# EasyEDA schematic SCH_N3 FLIGHT COMPUTER_2023-10-18 (1).json
TITLE: NAKUJA N3 FLIGHT COMPUTER; REV: 1.0; Date: 2023-10-05; Sheet: 1/1; Drawn By: Kisaka the Jones; Company: JICA NAKUJA
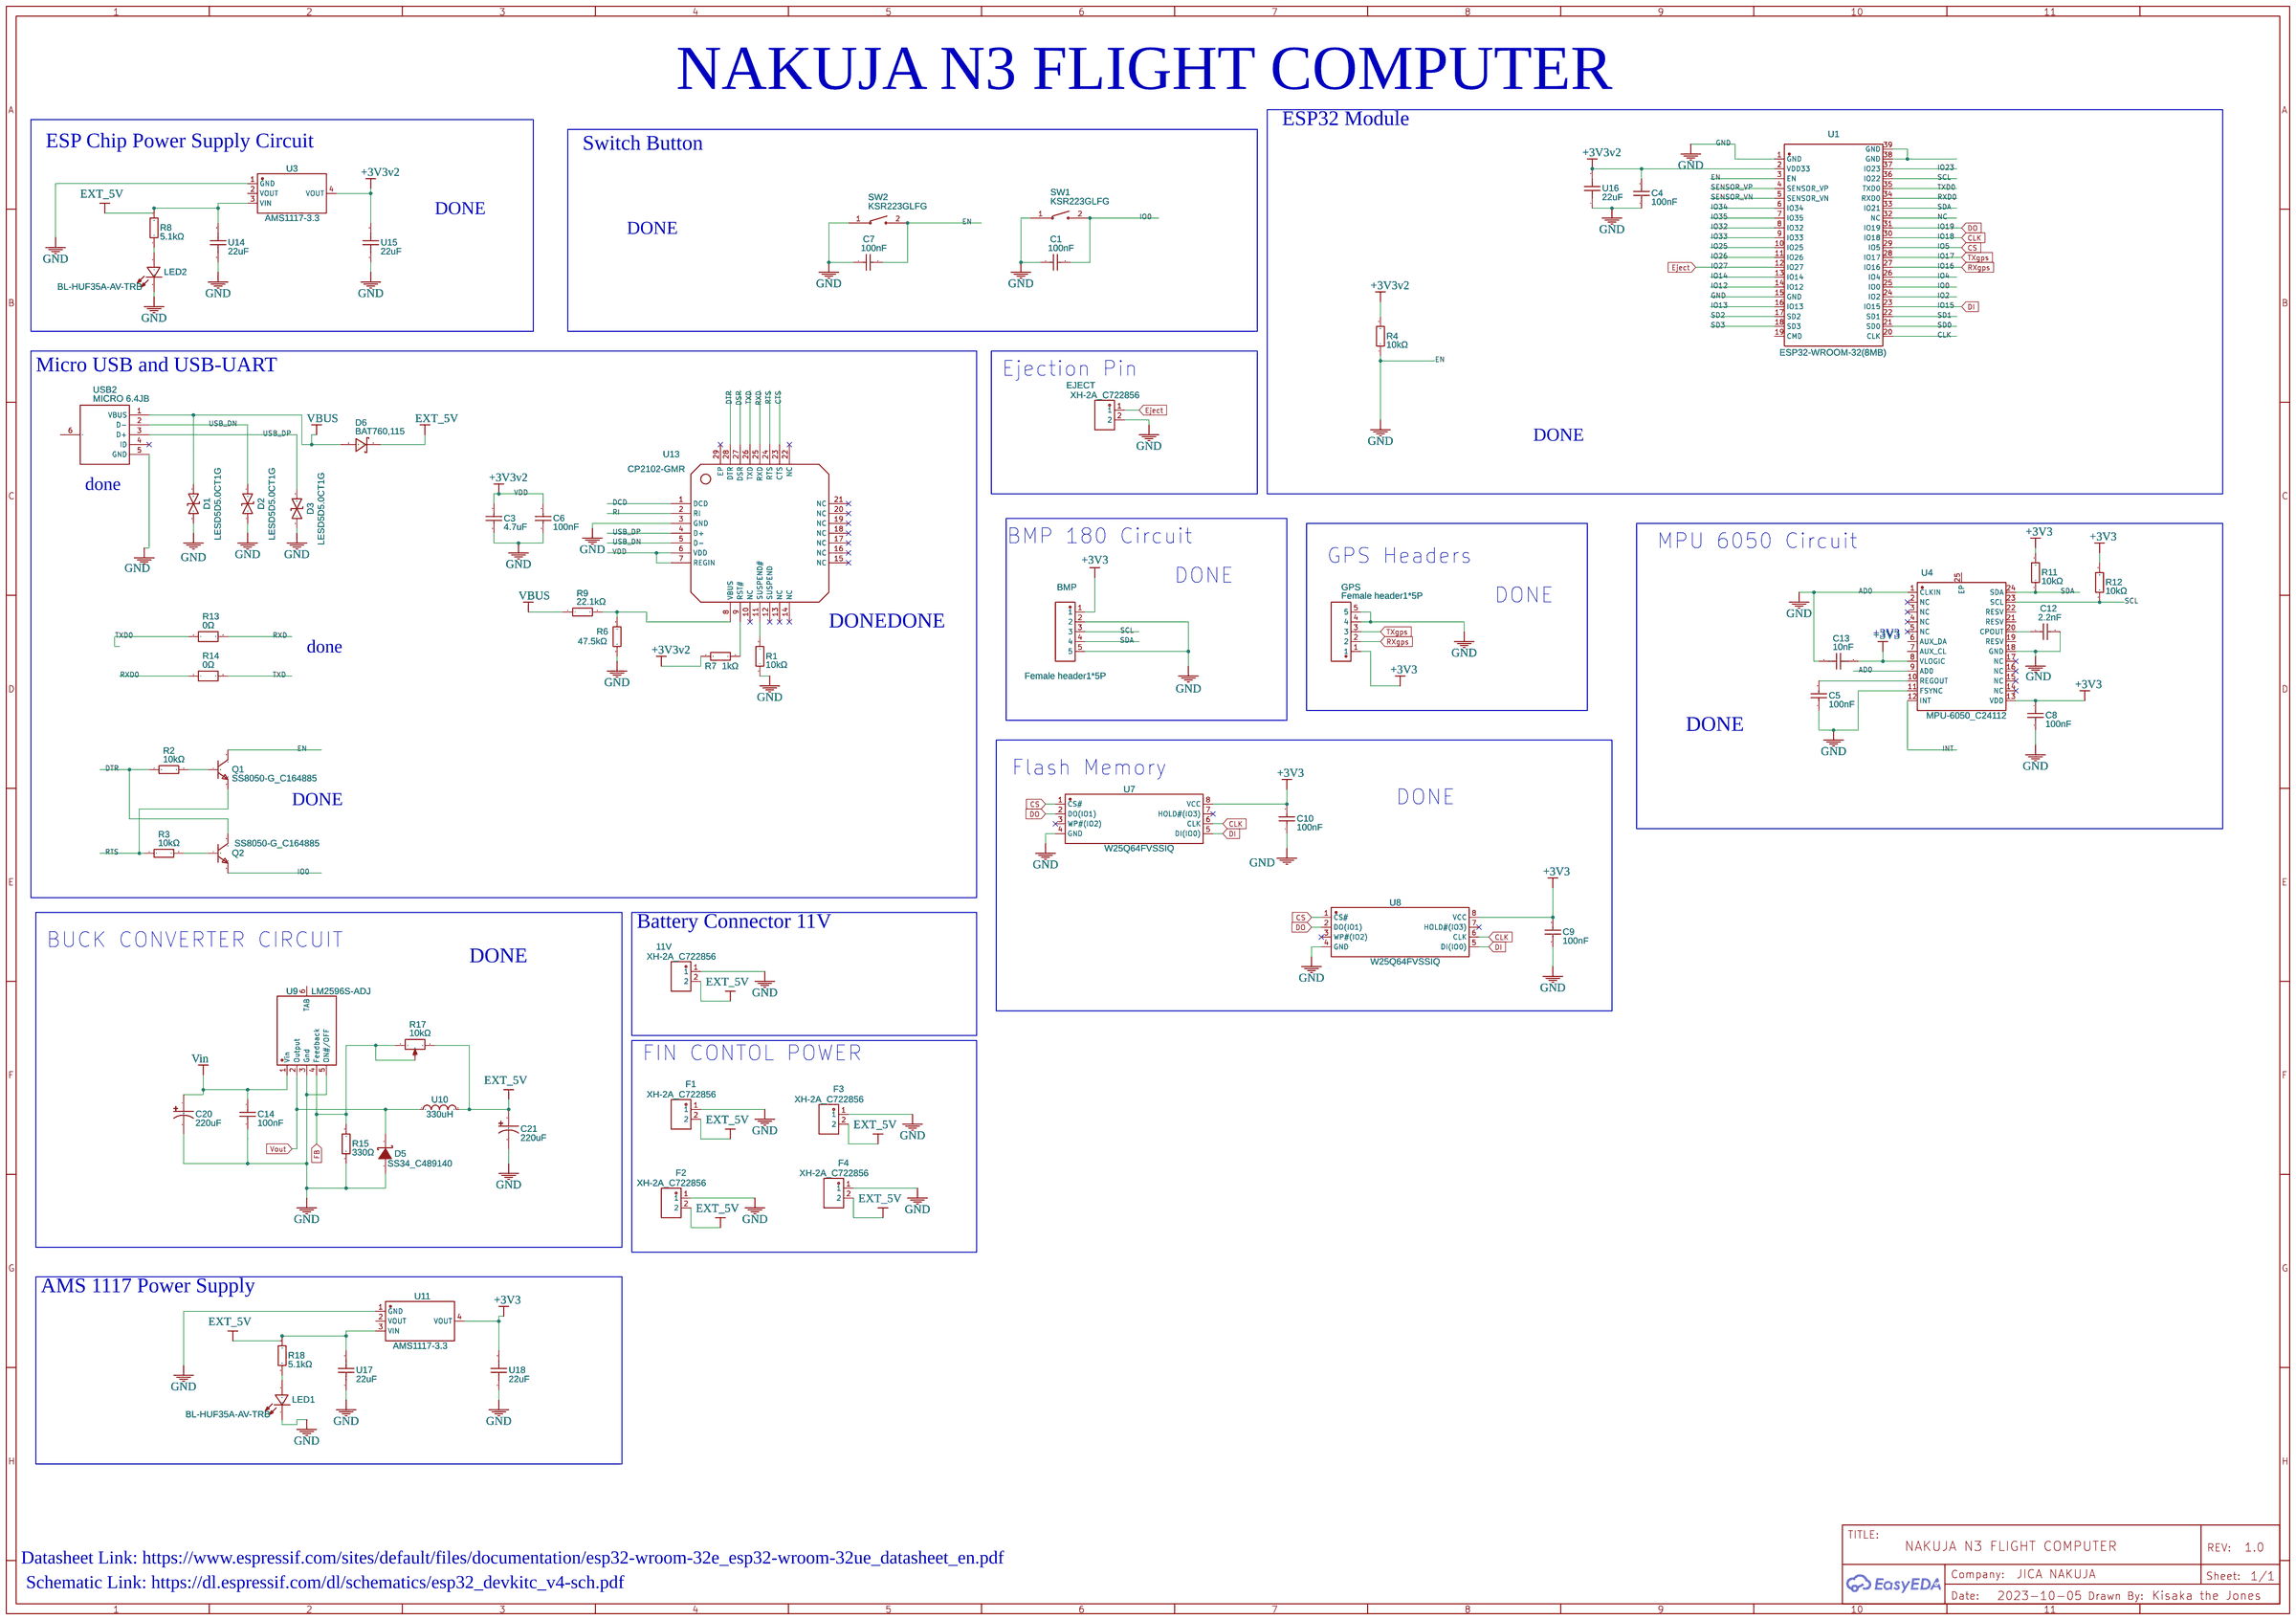
[diagram p0: schematic sheet]

## Parts
11V  XH-2A_C722856  [CONN-TH_XH-2A_C722856]
BMP  Female header1*5P  [HDR-TH_5P-P2.00-V-F-1]
C1  100nF  [C0402]
C3  4.7uF  [C0805]
C4  100nF  [C0402]
C5  100nF  [C0402]
C6  100nF  [C0402]
C7  100nF  [C0402]
C8  100nF  [C0402]
C9  100nF  [C0402]
C10  100nF  [C0402]
C12  2.2nF  [C0805]
C13  10nF  [C0805]
C14  100nF  [C0402]
C20  220uF  [CAP-SMD_BD10.0-L10.3-W10.3-FD]
C21  220uF  [CAP-SMD_BD10.0-L10.3-W10.3-FD]
D1  LESD5D5.0CT1G  [SOD-523_L1.2-W0.8-LS1.6-BI]
D2  LESD5D5.0CT1G  [SOD-523_L1.2-W0.8-LS1.6-BI]
D3  LESD5D5.0CT1G  [SOD-523_L1.2-W0.8-LS1.6-BI]
D5  SS34_C489140  [SMA_L4.3-W2.6-LS5.2-RD]
D6  BAT760,115  [SOD-323_L1.7-W1.3-LS2.5-RD]
EJECT  XH-2A_C722856  [CONN-TH_XH-2A_C722856]
F1  XH-2A_C722856  [CONN-TH_XH-2A_C722856]
F2  XH-2A_C722856  [CONN-TH_XH-2A_C722856]
F3  XH-2A_C722856  [CONN-TH_XH-2A_C722856]
F4  XH-2A_C722856  [CONN-TH_XH-2A_C722856]
GPS  Female header1*5P  [HDR-TH_5P-P2.00-V-F-1]
LED1  BL-HUF35A-AV-TRB  [LED0805-RD_RED]
LED2  BL-HUF35A-AV-TRB  [LED0805-RD_RED]
Q1  SS8050-G_C164885  [SOT-23-3_L2.9-W1.3-P1.90-LS2.4-BR]
Q2  SS8050-G_C164885  [SOT-23-3_L2.9-W1.3-P1.90-LS2.4-BR]
R1  10kΩ  [R1206]
R2  10kΩ  [R1206]
R3  10kΩ  [R1206]
R4  10kΩ  [R1206]
R6  47.5kΩ  [R0402]
R7  1kΩ  [R0402]
R8  5.1kΩ  [R0402]
R9  22.1kΩ  [R0402]
R11  10kΩ  [R1206]
R12  10kΩ  [R1206]
R13  0Ω  [R0402]
R14  0Ω  [R0402]
R15  330Ω  [R0603]
R17  10kΩ  [RES-ADJ-TH_3296W]
R18  5.1kΩ  [R0402]
SW1  KSR223GLFG  [KEY-SMD_2P-L6.0-W3.8-LS7.30-L]
SW2  KSR223GLFG  [KEY-SMD_2P-L6.0-W3.8-LS7.30-L]
U1  ESP32-WROOM-32(8MB)  [WIFIM-SMD_39P-L25.5-W18.0-P1.27]
U3  AMS1117-3.3  [SOT-223-3_L6.5-W3.4-P2.30-LS7.0-BR]
U4  MPU-6050_C24112  [QFN-24_L4.0-W4.0-P0.50-BL-EP2.7]
U7  W25Q64FVSSIQ  [SOIC-8_L5.3-W5.3-P1.27-LS8.0-BL]
U8  W25Q64FVSSIQ  [SOIC-8_L5.3-W5.3-P1.27-LS8.0-BL]
U9  LM2596S-ADJ  [TO-263-5_L10.2-W8.9-P1.70-BR]
U10  330uH  [IND-SMD_L12.5-W12.5_SLF12575T]
U11  AMS1117-3.3  [SOT-223-3_L6.5-W3.4-P2.30-LS7.0-BR]
U13  CP2102-GMR  [WQFN-28_L5.0-W5.0-P0.50-BL-EP3.2]
U14  22uF  [C0805]
U15  22uF  [C0805]
U16  22uF  [C0805]
U17  22uF  [C0805]
U18  22uF  [C0805]
USB2  MICRO 6.4JB  [MICRO-USB-SMD_C2681558]

## Library data of the parts
11V EJECT F1-F4 = XH-2A_C722856: Contributor: LCSC; Supplier: LCSC; Supplier Part: C722856; Manufacturer: CAX; Manufacturer Part: XH-2A; JLCPCB Part Class: Extended Part; link: https://lcsc.com/eda_search?q=C722856&%26type=1&ref=editor
BMP GPS = Female header1*5P: Supplier: LCSC; Manufacturer: BOOMELE(博穆精密); Manufacturer Part: 2.0-1*5P母; Supplier Part: C66508; JLCPCB Part Class: Extended Part; link: https://lcsc.com/eda_search?q=C66508&%26type=1&ref=editor
C1 C4-C10 C14 = FN15X104K160PNG: Contributor: LCSC; Supplier: LCSC; Supplier Part: C328914; Manufacturer: PSA(信昌电陶); JLCPCB Part Class: Extended Part; link: https://lcsc.com/eda_search?q=C328914&%26type=1&ref=editor
C3 = CL21B475KPFNNNE: Supplier: LCSC; Manufacturer: SAMSUNG(三星); Supplier Part: C87998; JLCPCB Part Class: Extended Part; link: https://lcsc.com/eda_search?q=C87998&%26type=1&ref=editor
C12 = 0805B222K500NT: Supplier: LCSC; Manufacturer: FH(风华); Supplier Part: C36576; JLCPCB Part Class: Extended Part; link: https://lcsc.com/eda_search?q=C36576&%26type=1&ref=editor
C13 = CC0805KRX7R9BB103: Supplier: LCSC; Manufacturer: YAGEO(国巨); Supplier Part: C83170; JLCPCB Part Class: Extended Part; link: https://lcsc.com/eda_search?q=C83170&%26type=1&ref=editor
C20 C21 = EEEFP1H221AP: Contributor: LCSC; Supplier: LCSC; Supplier Part: C178579; Manufacturer: PANASONIC(松下); JLCPCB Part Class: Extended Part; link: https://lcsc.com/eda_search?q=C178579&%26type=1&ref=editor
D1-D3 = LESD5D5.0CT1G: Contributor: LCSC; Supplier: LCSC; Supplier Part: C383211; Manufacturer: LRC(乐山无线电); JLCPCB Part Class: Extended Part; link: https://lcsc.com/eda_search?q=C383211&%26type=1&ref=editor
D5 = SS34_C489140: Contributor: LCSC; Supplier: LCSC; Supplier Part: C489140; Manufacturer: KEXIN(科信); Manufacturer Part: SS34; JLCPCB Part Class: Extended Part; link: https://lcsc.com/eda_search?q=C489140&%26type=1&ref=editor
D6 = BAT760,115: Contributor: LCSC; Supplier: LCSC; Supplier Part: C117941; Manufacturer: Nexperia(安世); JLCPCB Part Class: Extended Part; link: https://lcsc.com/eda_search?q=C117941&%26type=1&ref=editor
LED1 LED2 = BL-HUF35A-AV-TRB: Supplier: LCSC; Manufacturer: BrtLed(佰鸿); Supplier Part: C94741; JLCPCB Part Class: Extended Part; link: https://lcsc.com/eda_search?q=C94741&%26type=1&ref=editor
Q1 Q2 = SS8050-G_C164885: Contributor: LCSC; Supplier: LCSC; Supplier Part: C164885; Manufacturer: CJ(江苏长电/长晶); Manufacturer Part: SS8050-G; JLCPCB Part Class: Extended Part; link: https://lcsc.com/eda_search?q=C164885&%26type=1&ref=editor
R1-R4 R11 R12 = QR1206J10KP05: Contributor: LCSC; Supplier: LCSC; Supplier Part: C176266; Manufacturer: EVER OHMS(天二科技); Manufacturer Part: QR1206J10K0P05Z; JLCPCB Part Class: Extended Part; link: https://lcsc.com/eda_search?q=C176266&%26type=1&ref=editor
R6 = 0402WGF4752TCE: Supplier: LCSC; Manufacturer: UNI-ROYAL(厚声); Supplier Part: C25896; JLCPCB Part Class: Extended Part; link: https://lcsc.com/eda_search?q=C25896&%26type=1&ref=editor
R7 = 0402WGF1001TCE: Supplier: LCSC; Manufacturer: UNI-ROYAL(厚声); Supplier Part: C11702; JLCPCB Part Class: Basic Part; link: https://lcsc.com/eda_search?q=C11702&%26type=1&ref=editor
R8 R18 = 0402WGJ0512TCE: Supplier: LCSC; Manufacturer: UNI-ROYAL(厚声); Supplier Part: C25941; JLCPCB Part Class: Extended Part; link: https://lcsc.com/eda_search?q=C25941&%26type=1&ref=editor
R9 = 0402WGF2212TCE: Supplier: LCSC; Manufacturer: UNI-ROYAL(厚声); Supplier Part: C43473; JLCPCB Part Class: Extended Part; link: https://lcsc.com/eda_search?q=C43473&%26type=1&ref=editor
R13 R14 = CR0402F0R00Q10Z: Contributor: LCSC; Supplier: LCSC; Supplier Part: C881335; Manufacturer: EVER OHMS(天二科技); JLCPCB Part Class: Extended Part; link: https://lcsc.com/eda_search?q=C881335&%26type=1&ref=editor
R15 = RK73B1JTTD331J: Supplier: LCSC; Manufacturer: KOA; Supplier Part: C131709; JLCPCB Part Class: Extended Part; link: https://lcsc.com/eda_search?q=C131709&%26type=1&ref=editor
R17 = 3296W-1-103LF: Resistance(Ohms): 10K; Supplier: LCSC; Manufacturer: BOURNS; Supplier Part: C34846; JLCPCB Part Class: Extended Part; link: https://lcsc.com/eda_search?q=C34846&%26type=1&ref=editor
SW1 SW2 = KSR223GLFG: Contributor: LCSC; Supplier: LCSC; Supplier Part: C221786; Manufacturer: C&K; JLCPCB Part Class: Extended Part; link: https://lcsc.com/eda_search?q=C221786&%26type=1&ref=editor
U1 = ESP32-WROOM-32(8MB): Contributor: LCSC; Supplier: LCSC; Supplier Part: C529582; Manufacturer: ESPRESSIF(乐鑫); Manufacturer Part: ESP32-WROOM-32-N8; JLCPCB Part Class: Extended Part; link: https://lcsc.com/eda_search?q=C529582&%26type=1&ref=editor
U3 U11 = AMS1117-3.3: sourceId: dwIGgezVh; Supplier: LCSC; Manufacturer: AMS; Supplier Part: C6186; JLCPCB Part Class: Basic Part; link: https://lcsc.com/eda_search?q=C6186&%26type=1&ref=editor
U4 = MPU-6050_C24112: sourceId: 1T5FDZYC8; Supplier: LCSC; Manufacturer: TDK InvenSense(应美盛); Manufacturer Part: MPU-6050; Supplier Part: C24112; JLCPCB Part Class: Basic Part; link: https://lcsc.com/eda_search?q=C24112&%26type=1&ref=editor
U7 U8 = W25Q64FVSSIQ: Contributor: LCSC; Supplier: LCSC; Supplier Part: C2943203; Manufacturer: WINBOND(华邦); JLCPCB Part Class: Extended Part; link: https://lcsc.com/eda_search?q=C2943203&%26type=1&ref=editor
U9 = LM2596S-ADJ: Contributor: LCSC; Supplier: LCSC; Supplier Part: C347423; Manufacturer: UMW(友台半导体); JLCPCB Part Class: Extended Part; link: https://lcsc.com/eda_search?q=C347423&%26type=1&ref=editor
U10 = SLF12575T-331M1R0-H: Contributor: lcsc; Supplier: LCSC; Supplier Part: C2045258; Manufacturer: TDK; JLCPCB Part Class: Extended Part; link: https://lcsc.com/eda_search?q=C2045258&%26type=1&ref=editor
U13 = CP2102-GMR: Supplier: LCSC; Manufacturer: SILICON LABS(芯科); Supplier Part: C6568; JLCPCB Part Class: Basic Part; link: https://lcsc.com/eda_search?q=C6568&%26type=1&ref=editor
U14-U18 = V226M0805X5R100NHP: Contributor: lcsc; Supplier: LCSC; Supplier Part: C4749141; Manufacturer: VIIYONG(微容); JLCPCB Part Class: Extended Part; link: https://lcsc.com/eda_search?q=C4749141&%26type=1&ref=editor
USB2 = MICRO 6.4JB: Contributor: LCSC; Supplier: LCSC; Supplier Part: C2681558; Manufacturer: SHOU HAN(首韩); JLCPCB Part Class: Extended Part; link: https://lcsc.com/eda_search?q=C2681558&%26type=1&ref=editor

## Nets
+3V3: BMP.1 C8.2 C9.2 C10.2 C13.2 GPS.1 R11.2 R12.2 U4.8(VLOGIC) U4.13(VDD) U7.8(VCC) U8.8(VCC) U11.4(VOUT) U18.2
+3V3v2: C3.2 C4.2 C6.2 R4.2 R7.1 U1.2(VDD33) U3.4(VOUT) U13.6(VDD) U13.7(REGIN) U15.2 U16.2
VBUS: D1.2 D6.2(A) R9.1 USB2.1(VBUS)
Vin: C14.2 C20.1 U9.1(Vin)
AD0: 11V.1 BMP.2 BMP.5 C1.1 C3.1 C4.1 C5.1 C6.1 C7.1 C7.2 C8.1 C9.1 C10.1 C12.2 C13.1 C14.1 C20.2 C21.2 D1.1 D2.1 D3.1 D5.2(A) EJECT.2 F1.1 F2.1 F3.1 F4.1 GPS.4 GPS.5 LED1.1(C) LED2.1(C) Q1.3(C) R1.1 R4.1 R6.1 R15.1 SW1.1 SW2.1 SW2.2 U1.1(GND) U1.3(EN) U1.15(GND) U3.1(GND) U4.1(CLKIN) U4.9(AD0) U4.11(FSYNC) U4.18(GND) U7.4(GND) U8.4(GND) U9.3(Gnd) U9.5(ON#/OFF) U11.1(GND) U13.3(GND) U14.1 U15.1 U16.1 U17.1 U18.1 USB2.5(GND)
CLK: U1.20(CLK) U1.30(IO18) U7.6(CLK) U8.6(CLK)
CS: U1.29(IO5) U7.1(CS#) U8.1(CS#)
CTS: U13.23(CTS)
DCD: U13.1(DCD)
DI: U1.23(IO15) U7.5(DI(IO0)) U8.5(DI(IO0))
DO: U1.31(IO19) U7.2(DO(IO1)) U8.2(DO(IO1))
DSR: U13.27(DSR)
DTR: Q2.3(C) R2.1 U13.28(DTR)
Eject: EJECT.1 U1.12(IO27)
EXT_5V: 11V.2 C21.1 D6.1(K) F1.2 F2.2 F3.2 F4.2 R8.2 R17.3 R18.2 U3.3(VIN) U10.2 U11.3(VIN) U14.2 U17.2
FB: R15.2 R17.1 R17.2 U9.4(Feedback)
INT: U4.12(INT)
IO0: C1.2 Q2.2(E) SW1.2 U1.25(IO0)
IO2: U1.24(IO2)
IO4: U1.26(IO4)
IO12: U1.14(IO12)
IO13: U1.16(IO13)
IO14: U1.13(IO14)
IO16: GPS.2 U1.27(IO16)
IO17: GPS.3 U1.28(IO17)
IO23: U1.37(IO23)
IO25: U1.10(IO25)
IO26: U1.11(IO26)
IO32: U1.8(IO32)
IO33: U1.9(IO33)
IO34: U1.6(IO34)
IO35: U1.7(IO35)
NC: U1.32(NC)
RI: U13.2(RI)
RTS: Q1.2(E) R3.1 U13.24(RTS)
RXD: R13.2 U13.25(RXD)
RXD0: R14.1 U1.34(RXD0)
SCL: BMP.3 R12.1 U1.36(IO22) U4.23(SCL)
SD0: U1.21(SD0)
SD1: U1.22(SD1)
SD2: U1.17(SD2)
SD3: U1.18(SD3)
SDA: BMP.4 R11.1 U1.33(IO21) U4.24(SDA)
SENSOR_VN: U1.5(SENSOR_VN)
SENSOR_VP: U1.4(SENSOR_VP)
TXD: R14.2 U13.26(TXD)
TXD0: R13.1 U1.35(TXD0)
USB_DN: D2.2 U13.5(D-) USB2.2(D-)
USB_DP: D3.2 U13.4(D+) USB2.3(D+)
Vout: D5.1(K) U9.2(Output) U10.1
Net-(C5-2): C5.2 U4.10(REGOUT)
Net-(C12-1): C12.1 U4.20(CPOUT)
Net-(LED1-2): LED1.2(A) R18.1
Net-(LED2-2): LED2.2(A) R8.1
Net-(Q1-1): Q1.1(B) R2.2
Net-(Q2-1): Q2.1(B) R3.2
Net-(R1-2): R1.2 U13.11(SUSPEND#)
Net-(R6-2): R6.2 R9.2 U13.8(VBUS)
Net-(R7-2): R7.2 U13.9(RST#)
Net-(U1-38): U1.38(GND) U1.39(GND)

Not connected (* = marked no-connect by the designer): U1 19(CMD); U3 2(VOUT); U4 2(NC)* 3(NC)* 4(NC)* 5(NC)* 6(AUX_DA) 7(AUX_CL) 14(NC)* 15(NC)* 16(NC)* 17(NC)* 19(RESV) 21(RESV) 22(RESV) 25(EP); U7 3(WP#(IO2))* 7(HOLD#(IO3))*; U8 3(WP#(IO2))* 7(HOLD#(IO3))*; U9 6(TAB); U11 2(VOUT); U13 10(NC)* 12(SUSPEND)* 13(NC)* 14(NC)* 15(NC)* 16(NC)* 17(NC)* 18(NC)* 19(NC)* 20(NC)* 21(NC)* 22(NC)* 29(EP)*; USB2 4(ID)* 6(EH)

## Notes on the sheet
- NAKUJA N3 FLIGHT COMPUTER
- ESP32 Module
- ESP Chip Power Supply Circuit
- Switch Button
- DONE
- DONE
- Micro USB and USB-UART
- Ejection Pin
- DONE
- done
- BMP 180 Circuit
- MPU 6050 Circuit
- GPS Headers
- DONE
- DONE
- DONEDONE
- +3V3
- done
- DONE
- Flash Memory
- DONE
- DONE
- Battery Connector 11V
- BUCK CONVERTER CIRCUIT
- DONE
- FIN CONTOL POWER
- AMS 1117 Power Supply
- Datasheet Link: https://www.espressif.com/sites/default/files/documentation/esp32-wroom-32e_esp32-wroom-32ue_datasheet_en.pdf
- Schematic Link: https://dl.espressif.com/dl/schematics/esp32_devkitc_v4-sch.pdf
